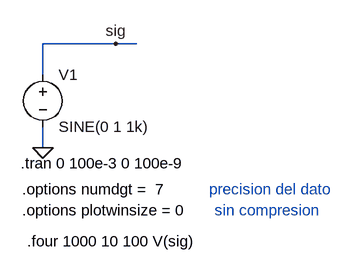
[diagram p0: schematic FFT1.asc]
FFT1.asc, the LTspice schematic file:
Version 4
SHEET 1 880 680
WIRE 144 48 32 48
WIRE 176 48 144 48
WIRE 32 96 32 48
WIRE 32 208 32 176
FLAG 32 208 0
FLAG 144 48 sig
SYMBOL voltage 32 80 R0
WINDOW 123 0 0 Left 0
WINDOW 39 0 0 Left 0
SYMATTR InstName V1
SYMATTR Value SINE(0 1 1k)
TEXT -2 232 Left 2 !.tran 0 100e-3 0 100e-9
TEXT 0 272 Left 2 !.options numdgt =  7
TEXT 0 304 Left 2 !.options plotwinsize = 0
TEXT 288 272 Left 2 ;precision del dato
TEXT 296 304 Left 2 ;sin compresion
TEXT 8 352 Left 2 !.four 1000 10 100 V(sig)

The netlist it stands for:
* FFT1.asc
V1 sig 0 SINE(0 1 1k)
.tran 0 100e-3 0 100e-9
.options numdgt =  7
.options plotwinsize = 0
* precision del dato
* sin compresion
.four 1000 10 100 V(sig)
.backanno
.end